# Altium schematic sheet RD.SchDoc
size C
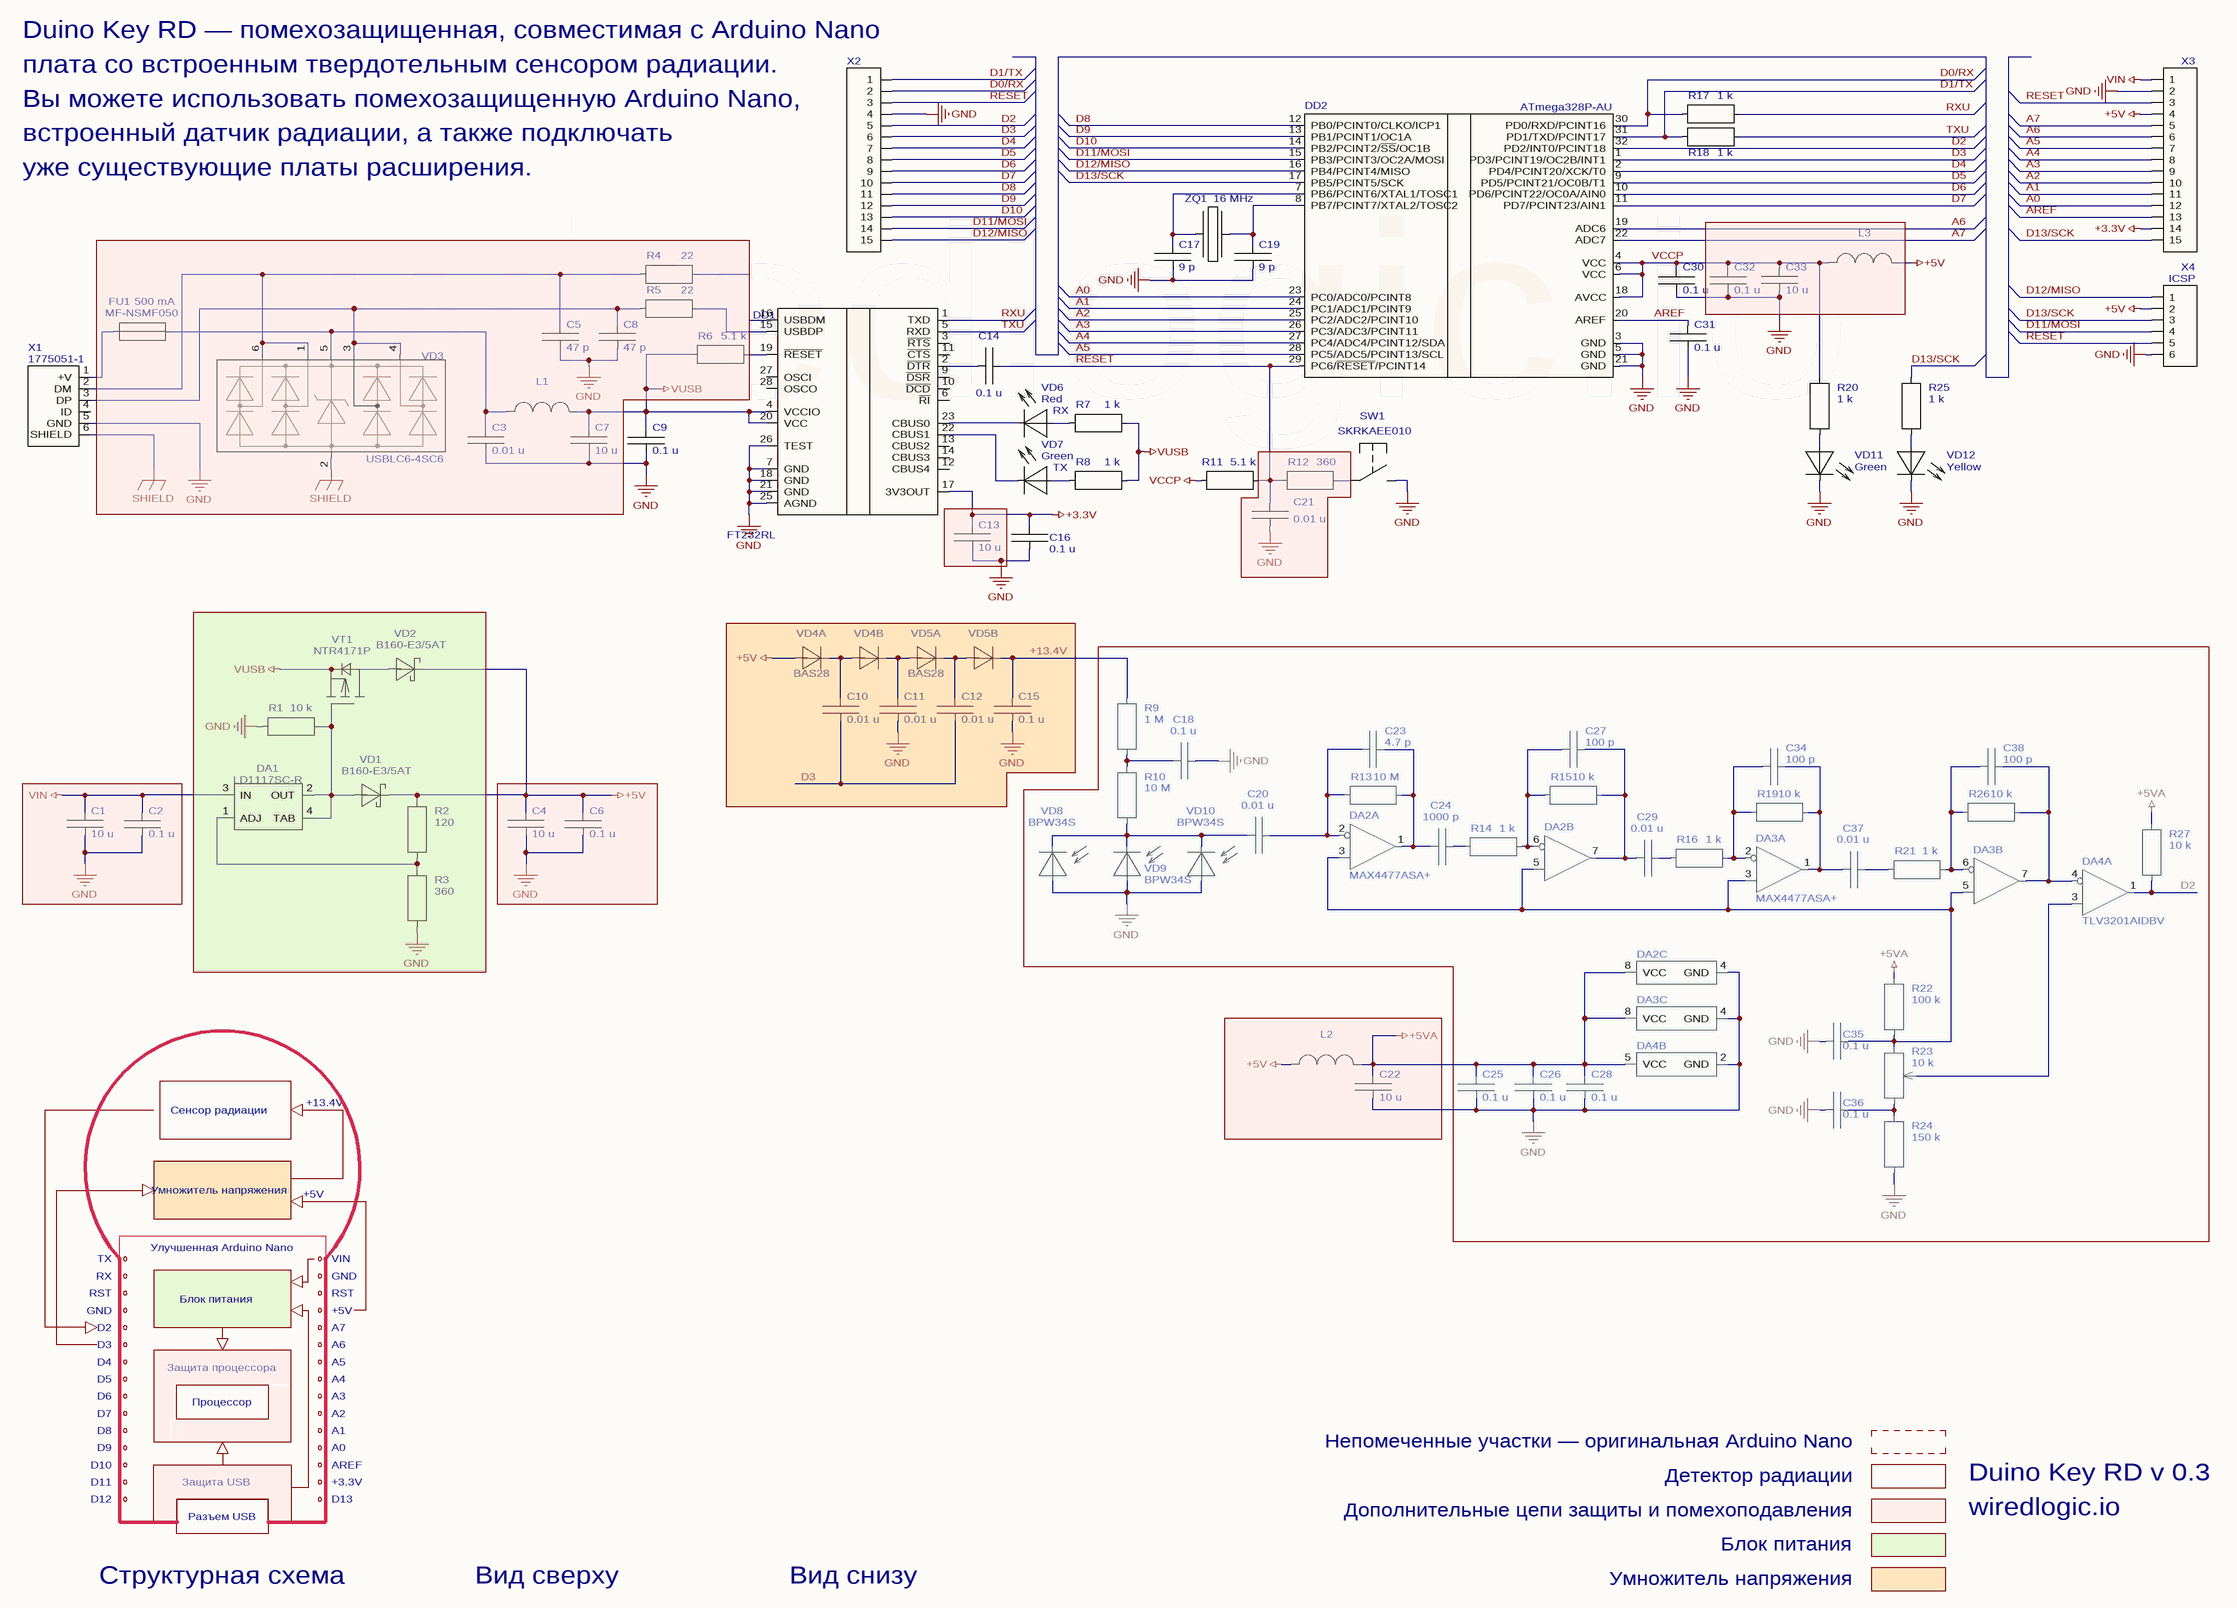
[diagram p0: RD.SchDoc]

## Parts
C1  value 10 u  [C1206-1.6mm]
C2  value 0.1 u  [C0805-0.94mm]
C3  value 0.01 u  [C0805-0.94mm]
C4  value 10 u  [C1206-1.6mm]
C5  value 47 p  [C0805-0.94mm]
C6  value 0.1 u  [C0805-0.94mm]
C7  value 10 u  [C1206-1.6mm]
C8  value 47 p  [C0805-0.94mm]
C9  value 0.1 u  [C0805-0.94mm]
C10  value 0.01 u  [C0805-0.94mm]
C11  value 0.01 u  [C0805-0.94mm]
C12  value 0.01 u  [C0805-0.94mm]
C13  value 10 u  [C1206-1.6mm]
C14  value 0.1 u  [C0805-0.94mm]
C15  value 0.1 u  [C0805-0.94mm]
C16  value 0.1 u  [C0805-0.94mm]
C17  value 9 p  [C0805-0.94mm]
C18  value 0.1 u  [C0805-0.94mm]
C19  value 9 p  [C0805-0.94mm]
C20  value 0.01 u  [C0805-0.94mm]
C21  value 0.01 u  [C0805-0.94mm]
C22  value 10 u  [C1206-1.6mm]
C23  value 4.7 p  [C0805-0.94mm]  (hidden comment: C0805 4.7p)
C24  value 1000 p  [C0805-0.94mm]
C25  value 0.1 u  [C0805-0.94mm]
C26  value 0.1 u  [C0805-0.94mm]
C27  value 100 p  [C0805-0.94mm]
C28  value 0.1 u  [C0805-0.94mm]
C29  value 0.01 u  [C0805-0.94mm]
C30  value 0.1 u  [C0805-0.94mm]
C31  value 0.1 u  [C0805-0.94mm]
C32  value 0.1 u  [C0805-0.94mm]
C33  value 10 u  [C1206-1.6mm]
C34  value 100 p  [C0805-0.94mm]
C35  value 0.1 u  [C0805-0.94mm]
C36  value 0.1 u  [C0805-0.94mm]
C37  value 0.01 u  [C0805-0.94mm]
C38  value 100 p  [C0805-0.94mm]
DA1  Part Number: LD1117SC-R  [SOT-223-LD1117SC-R]
DA2  Part Number: MAX4477ASA+  [SOIC8-MAX4477ASA]  (parts A,B,C of 3)
DA3  Part Number: MAX4477ASA+  [SOIC8-MAX4477ASA]  (parts A,B,C of 3)
DA4  Part Number: TLV3201AIDBV  [SOT23-5-TLV3201AIDBV]  (parts A,B of 2)
DD1  Part Number: FT232RL  [SSOP-28-FT232RL]
DD2  Part Number: ATmega328P-AU  [TQFP32-ATmega328P-AU]
FU1  value 500 mA  Part Number: MF-NSMF050  [FU-MF-NSMF050]
L1  (no value)  [L-ILHB1206]
L2  (no value)  [L-ILHB1206]
L3  (no value)  [L-ILHB1206]
R1  value 10 k  [R0805-1-10k]
R2  value 120  [R0805-1-120]
R3  value 360  [R0805-1-360]
R4  value 22  [R0805-1-22]
R5  value 22  [R0805-1-22]
R6  value 5.1 k  [R0805-1-5.1k]
R7  value 1 k  [R0805-1-1k]
R8  value 1 k  [R0805-1-1k]
R9  value 1 M  [R0805-1-1M]
R10  value 10 M  [R0805-1-10M]
R11  value 5.1 k  [R0805-1-5.1k]
R12  value 360  [R0805-1-360]
R13  value 10 M  [R0805-1-10M]
R14  value 1 k  [R0805-1-1k]
R15  value 10 k  [R0805-1-10k]
R16  value 1 k  [R0805-1-1k]
R17  value 1 k  [R0805-1-1k]
R18  value 1 k  [R0805-1-1k]
R19  value 10 k  [R0805-1-10k]
R20  value 1 k  [R0805-1-1k]
R21  value 1 k  [R0805-1-1k]
R22  value 100 k  [R0805-1-100k]
R23  value 10 k  [R Trim 10k 3319]
R24  value 150 k  [R0805-1-150k]
R25  value 1 k  [R0805-1-1k]
R26  value 10 k  [R0805-1-10k]
R27  value 10 k  [R0805-1-10k]
SW1  Part Number: SKRKAEE010  [SW SKRKAEE010]
VD1  Part Number: B160-E3/5AT  [DO-214AC-B160]
VD2  Part Number: B160-E3/5AT  [DO-214AC-B160]
VD3  Part Number: USBLC6-4SC6  [SOT23-6-USBLC6-4]
VD4  Part Number: BAS28  [SOT143B]  (parts A,B of 2)
VD5  Part Number: BAS28  [SOT143B]  (parts A,B of 2)
VD6  value Red  [VD LED 0805]
VD7  value Green  [VD LED 0805]
VD8  Part Number: BPW34S  [VD BPW34S]
VD9  Part Number: BPW34S  [VD BPW34S]
VD10  Part Number: BPW34S  [VD BPW34S]
VD11  value Green  [VD LED 0805]
VD12  value Yellow  [VD LED 0805]
VT1  Part Number: NTR4171P  [SOT23-NTR4171P]
X1  Part Number: 1775051-1  [X USB 1775051-1]
X2  (no value)  [X PLS-15]
X3  (no value)  [X PLS-15]
X4  (no value)  [X PLD-6]
ZQ1  value 16 MHz  [ZQ TSX-3225 16.0000MF09Z-AC3]

## Nets
+3.3V: C13.1 C16.2 DD1.17(3V3OUT) X3.14
+5V: C4.1 C6.2 L2.2 L3.1 R2.1 VD1.1 VD2.1 VD4.4 X3.4 X4.2
+5VA: C22.1 C25.2 C26.2 C28.2 DA2.8(VCC) DA3.8(VCC) DA4.5(VCC) L2.1 R22.1 R27.2
GND: C1.2 C2.1 C3.2 C4.2 C5.2 C6.1 C7.2 C8.2 C9.1 C11.1 C13.2 C15.1 C16.1 C17.2 C18.2 C19.2 C21.1 C22.2 C25.1 C26.1 C28.1 C30.1 C31.1 C32.1 C33.2 C35.1 C36.1 DA2.4(GND) DA3.4(GND) DA4.2(GND) DD1.7(GND) DD1.18(GND) DD1.21(GND) DD1.25(AGND) DD1.26(TEST) DD2.3(GND) DD2.5(GND) DD2.21(GND) R1.1 R3.2 R24.2 SW1.1 VD8.2(A) VD9.2(A) VD10.2(A) VD11.1(K) VD12.1(K) X1.5(GND) X2.4 X3.2 X4.6
SHIELD: VD3.2 X1.6(SHIELD)
VCCP: C30.2 C32.2 C33.1 DD2.4(VCC) DD2.6(VCC) DD2.18(AVCC) L3.2 R11.1 R20.2
VIN: C1.1 C2.2 DA1.3(IN) X3.1
VUSB: C7.1 C9.2 DD1.4(VCCIO) DD1.20(VCC) L1.1 R6.1 R7.2 R8.2 VT1.2(S)
+13.4V: C15.2 R9.1 VD5.2
A0: DD2.23(PC0/ADC0/PCINT8) X3.12
A1: DD2.24(PC1/ADC1/PCINT9) X3.11
A2: DD2.25(PC2/ADC2/PCINT10) X3.10
A3: DD2.26(PC3/ADC3/PCINT11) X3.9
A4: DD2.27(PC4/ADC4/PCINT12/SDA) X3.8
A5: DD2.28(PC5/ADC5/PCINT13/SCL) X3.7
A6: DD2.19(ADC6) X3.6
A7: DD2.22(ADC7) X3.5
AREF: C31.2 DD2.20(AREF) X3.13
D0/RX: DD2.30(PD0/RXD/PCINT16) R17.1 X2.2
D1/TX: DD2.31(PD1/TXD/PCINT17) R18.1 X2.1
D2: DA4.1(OUT) DD2.32(PD2/INT0/PCINT18) R27.1 X2.5
D3: C10.1 C12.1 DD2.1(PD3/PCINT19/OC2B/INT1) X2.6
D4: DD2.2(PD4/PCINT20/XCK/T0) X2.7
D5: DD2.9(PD5/PCINT21/OC0B/T1) X2.8
D6: DD2.10(PD6/PCINT22/OC0A/AIN0) X2.9
D7: DD2.11(PD7/PCINT23/AIN1) X2.10
D8: DD2.12(PB0/PCINT0/CLKO/ICP1) X2.11
D9: DD2.13(PB1/PCINT1/OC1A) X2.12
D10: DD2.14(PB2/PCINT2/~{SS}/OC1B) X2.13
D11/MOSI: DD2.15(PB3/PCINT3/OC2A/MOSI) X2.14 X4.4
D12/MISO: DD2.16(PB4/PCINT4/MISO) X2.15 X4.1
D13/SCK: DD2.17(PB5/PCINT5/SCK) R25.2 X3.15 X4.3
RESET: C14.1 C21.2 DD2.29(PC6/~{RESET}/PCINT14) R11.2 R12.1 X2.3 X3.3 X4.5
RXU: DD1.1(TXD) R17.2
TXU: DD1.5(RXD) R18.2
NetC3_1: C3.1 FU1.2 L1.2 VD3.5
NetC5_1: C5.1 R4.1 VD3.1 VD3.6 X1.2(DM)
NetC8_1: C8.1 R5.1 VD3.3 VD3.4 X1.3(DP)
NetC10_2: C10.2 VD4.1 VD4.3
NetC11_2: C11.2 VD4.2 VD5.4
NetC12_2: C12.2 VD5.1 VD5.3
NetC14_2: C14.2 DD1.2(~{DTR})
NetC17_1: C17.1 DD2.7(PB6/PCINT6/XTAL1/TOSC1) ZQ1.1
NetC18_1: C18.1 R9.2 R10.1
NetC19_1: C19.1 DD2.8(PB7/PCINT7/XTAL2/TOSC2) ZQ1.3
NetC20_1: C20.1 R10.2 VD8.1(K) VD9.1(K) VD10.1(K)
NetC20_2: C20.2 C23.1 DA2.2(IN-) R13.1
NetC23_2: C23.2 C24.1 DA2.1(OUT) R13.2
NetC24_2: C24.2 R14.1
NetC27_1: C27.1 DA2.6(IN-) R14.2 R15.1
NetC27_2: C27.2 C29.1 DA2.7(OUT) R15.2
NetC29_2: C29.2 R16.1
NetC34_1: C34.1 DA3.2(IN-) R16.2 R19.1
NetC34_2: C34.2 C37.1 DA3.1(OUT) R19.2
NetC35_2: C35.2 DA2.3(IN+) DA2.5(IN+) DA3.3(IN+) DA3.5(IN+) R22.2 R23.1
NetC36_2: C36.2 R23.2 R24.1
NetC37_2: C37.2 R21.1
NetC38_1: C38.1 DA3.6(IN-) R21.2 R26.1
NetC38_2: C38.2 DA3.7(OUT) DA4.4(IN-) R26.2
NetDA1_1: DA1.1(ADJ) R2.2 R3.1
NetDA1_2: DA1.2(OUT) DA1.4(TAB) R1.2 VD1.2 VT1.1(G)
NetDA4_3: DA4.3(IN+) R23.3
NetDD1_15: DD1.15(USBDP) R5.2
NetDD1_16: DD1.16(USBDM) R4.2
NetDD1_19: DD1.19(~{RESET}) R6.2
NetDD1_22: DD1.22(CBUS1) VD7.1(K)
NetDD1_23: DD1.23(CBUS0) VD6.1(K)
NetFU1_1: FU1.1 X1.1(+V)
NetR7_1: R7.1 VD6.2(A)
NetR8_1: R8.1 VD7.2(A)
NetR12_2: R12.2 SW1.2
NetR20_1: R20.1 VD11.2(A)
NetR25_1: R25.1 VD12.2(A)
NetVD2_2: VD2.2 VT1.3(D)

Not connected (* = marked no-connect by the designer): DD1 3(~{RTS}) 6(~{RI}) 9(~{DSR}) 10(~{DCD}) 11(~{CTS}) 12(CBUS4) 13(CBUS2) 14(CBUS3) 27(OSCI) 28(OSCO); X1 4(ID)

## Notes on the sheet
- Duino Key RD — помехозащищенная, совместимая с Arduino Nano
- плата со встроенным твердотельным сенсором радиации.
- Вы можете использовать помехозащищенную Arduino Nano,
- встроенный датчик радиации, а также подключать
- уже существующие платы расширения.
- wiredlogic.io
- (near X4) ICSP
- RX
- TX
- Сенсор радиации
- +13.4V
- Умножитель напряжения
- +5V
- Улучшенная Arduino Nano
- VIN
- RST
- GND
- Блок питания
- D2
- D3
- D4
- D5
- Защита процессора
- A7
- A6
- A5
- A4
- D6
- D7
- D8
- Процессор
- A3
- A2
- A1
- D9
- D10
- D11
- Защита USB
- A0
- AREF
- +3.3V
- Детектор радиации
- Непомеченные участки — оригинальная Arduino Nano
- Duino Key RD v 0.3
- D12
- Разъем USB
- D13
- Дополнительные цепи защиты и помехоподавления
- Структурная схема
- Вид сверху
- Вид снизу
- Title
- Size:
- Date:
- Number:
- Time:
- Revision:
- Sheet
- of
- File:

## Library data of the parts
C1 C4 C7 C13 C22 C33 = C1206 10u: Ceramic capacitor; Manufacturer: Yageo; Part Number: CC1206KKX7R8BB106; Note: 25 VDC X7R -55 +125 10%; Seller: Mouser; Price 10: 0,258; Price 100: 0,123; Price 1000: 0,110
C2 C6 C9 C14-C16 C18 C25 C26 C28 C30-C32 C35 C36 = C0805 0.1u: Ceramic capacitor; Manufacturer: AVX; Part Number: 08055C104KAT2A; Note: 50 VDC X7R -55 +125 10%; Seller: Mouser; Price 10: 0,065; Price 100: 0,030; Price 1000: 0,017
C3 C10-C12 C20 C21 C29 C37 = C0805 0.01u: Ceramic capacitor; Manufacturer: AVX; Part Number: 08055C103KAT2A; Note: 50 VDC X7R -55 +125 10%; Seller: Mouser; Price 10: 0,058; Price 100: 0,026; Price 1000: 0,015
C5 C8 = C0805 47p: Ceramic capacitor; Manufacturer: Kemet; Part Number: C0805C470J5GACTU; Note: 50 VDC C0G (NP0) -55 +125 10%; Seller: Mouser; Price 10: 0,041; Price 100: 0,028; Price 1000: 0,019
C17 C19 = C0805 9p: Ceramic capacitor; Manufacturer: Yageo; Part Number: CC0805DRNPO9BN9R0; Note: 50 VDC C0G (NP0) -55 +125 0.5pF; Seller: Mouser; Price 10: 0,08; Price 100: 0,037; Price 1000: 0,028
C23 = C0805 4.7p: Ceramic capacitor; Manufacturer: Yageo; Part Number: CC0805CRNPO9BN4R7; Note: 50VDC C0G (NP0) -55 +125 +-0.25p; Seller: Mouser; Price 10: 0,091; Price 100: 0,058; Price 1000: 0,043
C24 = C0805 1000p: Ceramic capacitor; Manufacturer: Kemet; Part Number: C0805C102K5RACTU; Note: 50 VDC X7R -55 +125 10%; Seller: Mouser; Price 10: 0,037; Price 100: 0,026; Price 1000: 0,017
C27 C34 C38 = C0805 100p: Ceramic capacitor; Manufacturer: Kemet; Part Number: C0805C101J5GACTU; Note: 50 VDC C0G (NP0) -55 +125 10%; Seller: Mouser; Price 10: 0,045; Price 100: 0,030; Price 1000: 0,020
DA1 = DA LD1117SC-R: Adjustable LDO; Manufacturer: ST Microelectronics; Note: 800 mA 1.2V -40 +125 Min load 5 mA; Seller: Mouser; Price 10: 0,561; Price 100: 0,303; Price 1000: 0,227
DA2 DA3 = DA MAX4477ASA+: Operational amplifier; Manufacturer: Maxim; Seller: Mouser; Price 10: 2,58; Price 100: 2,58; Price 1000: 2,58
DA4 = DA TLV3201AIDBV: Push-pull output comparator; Manufacturer: TI; Seller: Mouser; Price 10: 1,67; Price 100: 1,31; Price 1000: 0,773
DD1 = DD FT232RL: USB to UART interface; Manufacturer: FTDI; Seller: Mouser; Price 10: 6,39; Price 100: 5,76; Price 1000: 4,18
DD2 = DD ATmega328P-AU: AVR Microcontroller; Manufacturer: Atmel; Seller: Mouser; Price 10: 3,27; Price 100: 2,71; Price 1000: 2,64
FU1 = FU 0.5A: PTC resettable fuse; Manufacturer: Bourns; Note: Hold 0.5A Trip 1A -40 +85 Vmax 13.2; Seller: Mouser; Price 10: 0,431; Price 100: 0,411; Price 1000: 0,411
L1-L3 = L ILHB1206ER601V: Multilayer ferrite bead; Manufacturer: Vishay; Note: 2.5A 25% 600 Ohms; Seller: Mouser; Part Number: ILHB1206ER601V; Price 10: 0,189; Price 100: 0,134; Price 1000: 0,110
R1 R15 R19 R26 R27 = R0805 10k: Thick film resistor; Manufacturer: Yageo; Part Number: RC0805FR-0710KL; Note: 150 VDC -55 +155 1% 125mW; Seller: Mouser; Price 1000: 0,006; Price 10: 0,026; Price 100: 0,009
R2 = R0805 120: Thick film resistor; Manufacturer: Yageo; Part Number: RC0805FR-07120RL; Note: 150 VDC -55 +155 1% 125mW; Seller: Mouser; Price 10: 0,026; Price 100: 0,009; Price 1000: 0,006
R3 R12 = R0805 360: Thick film resistor; Manufacturer: Yageo; Part Number: RC0805FR-07360RL; Note: 150 VDC -55 +155 1% 125mW 100PPM; Seller: Mouser; Price 100: 0,009; Price 1000: 0,006; Price 10: 0,026
R4 R5 = R0805 22: Thick film resistor; Manufacturer: Yageo; Part Number: RC0805FR-0722RL; Note: 150 VDC -55 +155 1% 125mW; Seller: Mouser; Price 10: 0,026; Price 100: 0,009; Price 1000: 0,006
R6 R11 = R0805 5.1k: Thick film resistor; Manufacturer: Yageo; Part Number: RC0805FR-075K1L; Note: 150 VDC -55 +155 1% 125mW; Seller: Mouser; Price 1000: 0,006; Price 100: 0,009; Price 10: 0,026
R7 R8 R14 R16-R18 R20 R21 R25 = R0805 1k: Thick film resistor; Manufacturer: Yageo; Part Number: RC0805FR-071KL; Note: 150 VDC -55 +155 1% 125mW; Seller: Mouser; Price 1000: 0,006; Price 100: 0,009; Price 10: 0,026
R9 = R0805 1M: Thick film resistor; Manufacturer: Yageo; Part Number: RC0805FR-071ML; Note: 150 VDC -55 +155 1% 125mW; Seller: Mouser; Price 10: 0,026; Price 1000: 0,006; Price 100: 0,009
R10 R13 = R0805 10M: Thick film resistor; Manufacturer: Yageo; Part Number: RC0805FR-0710ML; Note: 150 VDC -55 +155 1% 125mW; Seller: Mouser; Price 100: 0,007; Price 1000: 0,006; Price 10: 0,024
R22 = R0805 100k: Thick film resistor; Manufacturer: Yageo; Part Number: RC0805FR-07100KL; Note: 150 VDC -55 +155 1% 125mW; Seller: Mouser; Price 10: 0,026; Price 1000: 0,006; Price 100: 0,009
R23 = R Trim 10k 3319: Trimming resistor; Manufacturer: Bourns; Part Number: 3319P-1-103; Note: 200 VDC -25 +100 25% 200mW; Seller: Mouser; Price 10: 0,522; Price 100: 0,452; Price 1000: 0,39
R24 = R0805 150k: Thick film resistor; Manufacturer: Yageo; Part Number: RC0805FR-07150KL; Note: 150 VDC -55 +155 1% 125mW; Seller: Mouser; Price 1000: 0,006; Price 10: 0,026; Price 100: 0,009
SW1 = SW SKRKAEE010: Button; Manufacturer: ALPS; Note: 3.9x2.9x2 1.57N 200000cycles Travel0.13mm 100mOhm max 50mA 12VDC min 10uA 1VDC; Seller: Mouser; Price 1000: 0,723; Price 100: 0,802; Price 10: 0,962
VD1 VD2 = VD B160-E3/5AT: Shottky diode; Manufacturer: Vishay; Note: 1A 60V 0.75V@1A; Seller: Mouser; Price 1000: 0,097; Price 10: 0,349; Price 100: 0,171
VD3 = VD USBLC6-4SC6 One side: ESD protection; Manufacturer: ST; Seller: Mouser; Price 100: 0,318; Price 10: 0,520; Price 1000: 0,245
VD4 VD5 = VD BAS28: Double diode; Manufacturer: Nexperia; Note: 215mA 75V 1.25V@150mA; Seller: Mouser; Price 1000: 0,117; Price 10: 0,409; Price 100: 0,171
VD6 = VD LED 0805 Red: LED; Manufacturer: Lite-On; Part Number: LTST-C171KRKT; Note: 130 deg 639 nm 54 mcd typ; Seller: Mouser; Price 100: 0,121; Price 10: 0,392; Price 1000: 0,093
VD7 VD11 = VD LED 0805 Green: LED; Manufacturer: Lite-On; Part Number: LTST-C171GKT; Note: 130 deg 565 nm 12 mcd typ; Seller: Mouser; Price 10: 0,375; Price 100: 0,117; Price 1000: 0,089
VD8-VD10 = VD BPW34S: Photodiode; Manufacturer: Vishay; Note: 7.5 mm2 RiseTime100ns 25 pF; Seller: Mouser; Price 10: 1,36; Price 100: 1,08; Price 1000: 0,927
VD12 = VD LED 0805 Yellow: LED; Manufacturer: Lite-On; Part Number: LTST-C171KSKT; Note: 130 deg 588 nm 60 mcd typ; Seller: Mouser; Price 10: 0,422; Price 100: 0,132; Price 1000: 0,100
VT1 = VT NTR4171P: P-channel MOSFET; Manufacturer: ON Semiconductor; Note: 110mOhm @ 4.5V 30V 3.5A; Seller: Mouser; Price 1000: 0,173; Price 10: 0,424; Price 100: 0,228
X1 = X USB 1775051-1: USB connector; Manufacturer: TE; Note: Mini USB Type AB Female; Seller: Mouser; Price 100: 1,40; Price 10: 1,85; Price 1000: 1,40
X2 X3 = X PLS-15: PLS connector; Manufacturer: Molex; Seller: Mouser; Part Number: 22-28-4150; Price 100: 0,806; Price 1000: 0,585; Price 10: 0,916
X4 = X PLD-6: PLD connector; Manufacturer: TE Connectivity; Part Number: 5-146254-3; Seller: Mouser; Price 10: 0,726; Price 100: 0,492; Price 1000: 0,385
ZQ1 = ZQ TSX-3225 16.0000MF09Z-AC3: Crystal; Manufacturer: Citizen; Note: -20 +75 10 ppm; Seller: Mouser; Part Number: TSX-3225 16.0000MF09Z-AC3; Price 100: 0,537; Price 1000: 0,537; Price 10: 0,606